# Altium schematic sheet Series_White_LEDs.SchDoc: White Illumination LEDs
size A4; DrawnBy: Samyar Sadat Akhavi; Revision: 1.0; SheetNumber: 2; SheetTotal: 3
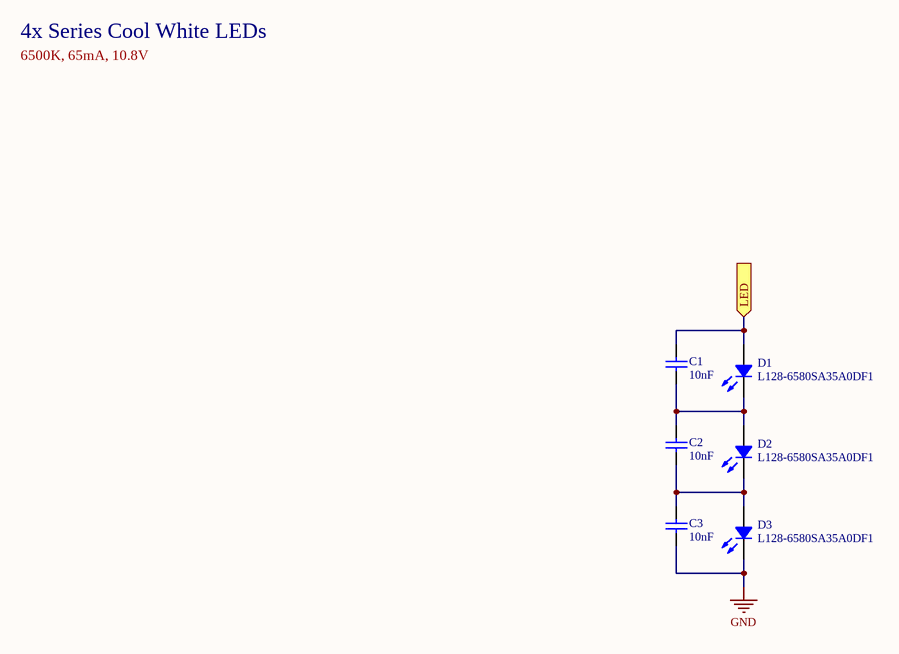
[diagram p0: Series_White_LEDs.SchDoc]

## Parts
?  (no value)  (graphical)
C1  10nF  [CAP_SMD_603]
C2  10nF  [CAP_SMD_603]
C3  10nF  [CAP_SMD_603]
D1  L128-6580SA35A0DF1  [CREE J 2835]
D2  L128-6580SA35A0DF1  [CREE J 2835]
D3  L128-6580SA35A0DF1  [CREE J 2835]

## Ports
LED (in, see Camera_LED_Module[3B])

## Nets
GND: C3.2 D3.2
LED: C1.1 D1.1 ; port LED
NetC1_2: C1.2 C2.1 D1.2 D2.1
NetC2_2: C2.2 C3.1 D2.2 D3.1

## Notes on the sheet
- 4x Series Cool White LEDs
- 6500K, 65mA, 10.8V
- Sub-Project:
- Size:
- Drawn By:
- Revision:
- Date:
- File:
- Sheet:
- of

## Library data of the parts
? = Standard Title Block
C1-C3 = Non-polar Capacitor: Generic Ceramic Capacitor; Voltage: 16V; Value: 10nF
D1-D3 = JE2835AWT-R-H40GA0000-N0000001: LED COOL WHITE 6500K LUXEON 2835 2.7V; Part Number: L128-6580SA35A0DF1